# EAGLE schematic clock02 (EAGLE 7.2.0)
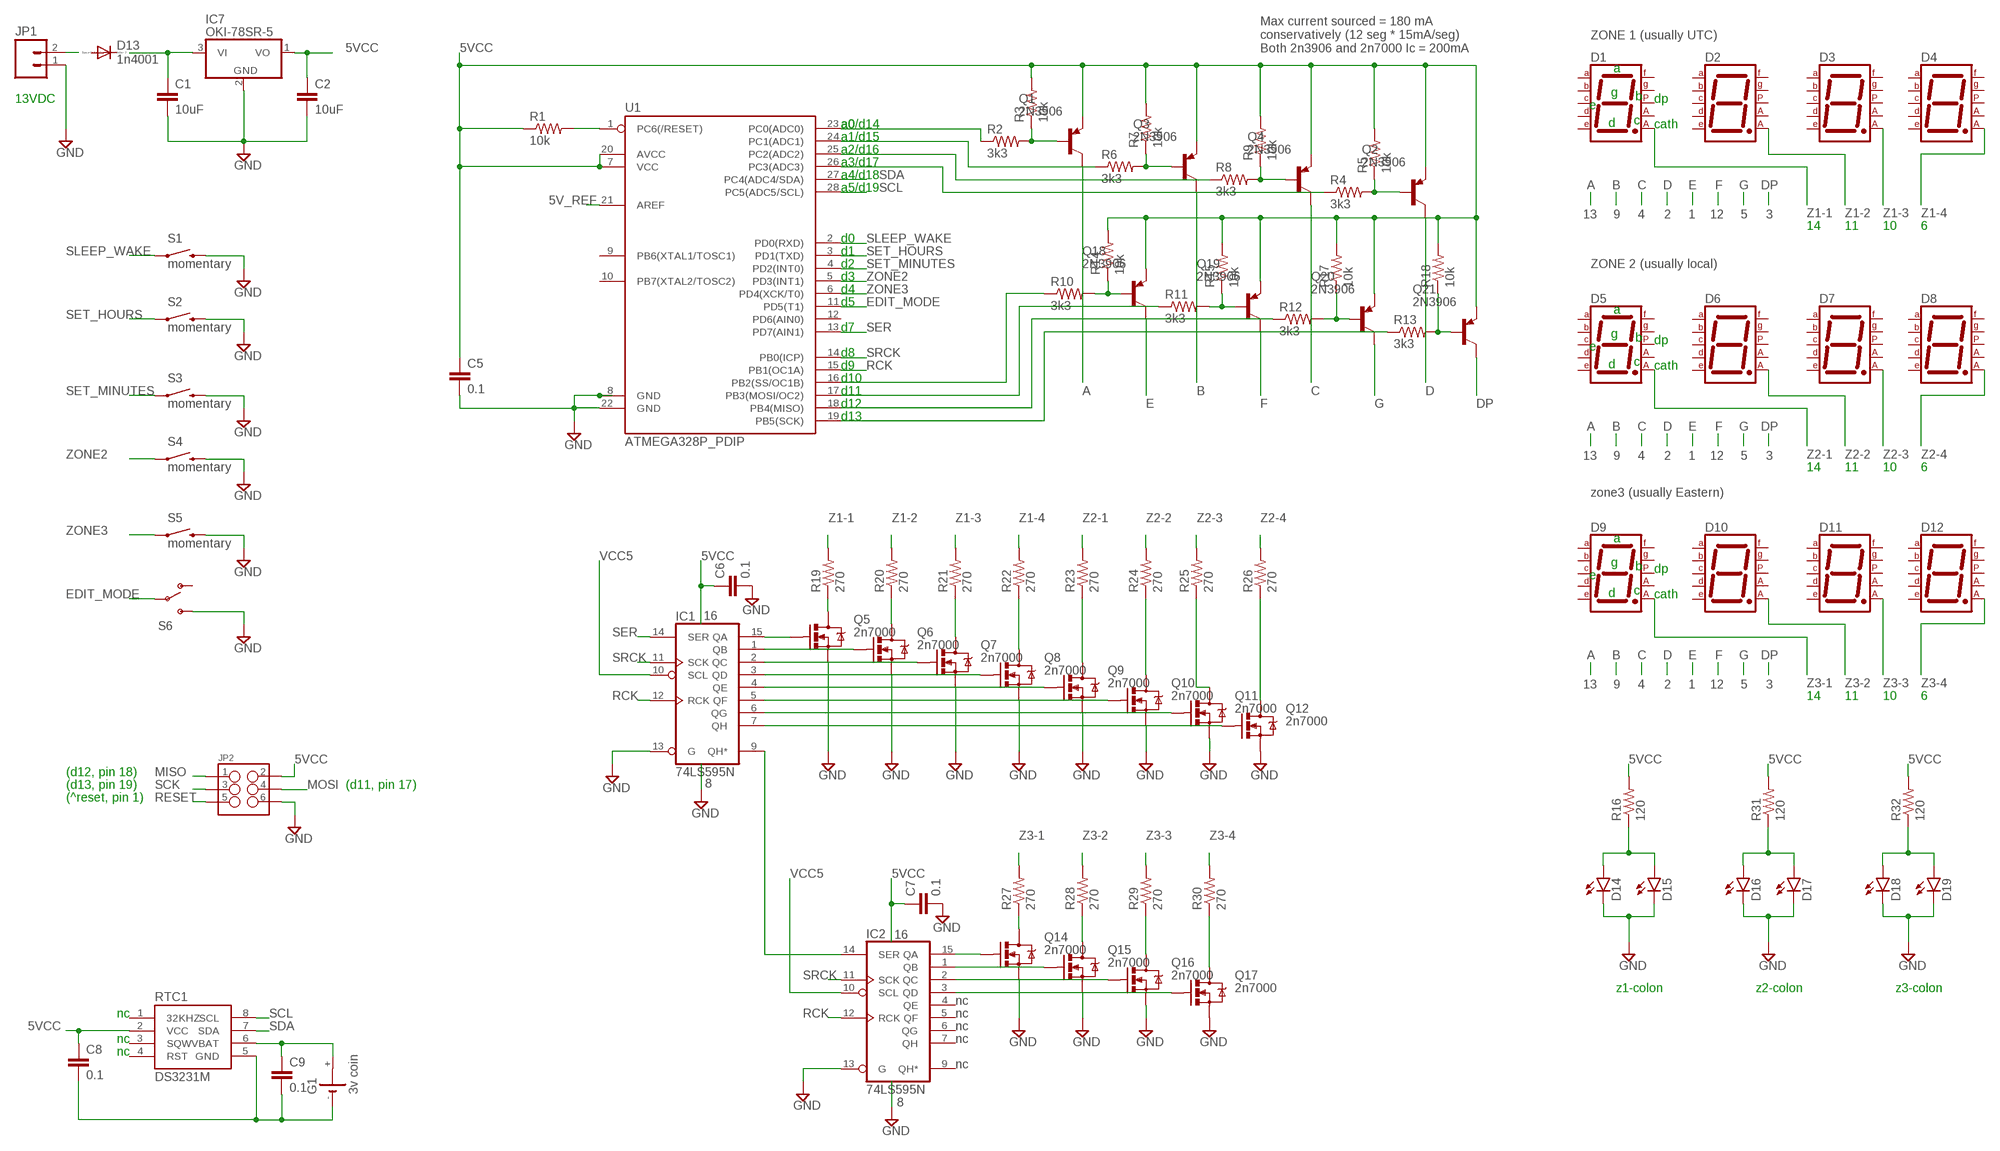
[diagram p0: schematic, sheet 1]

## Parts
C1  10uF  10NF/10000PF-50V-10%(0603)  [0603-CAP]
C2  10uF  10NF/10000PF-50V-10%(0603)  [0603-CAP]
C5  0.1  10NF/10000PF-50V-10%(0603)  [0603-CAP]
C6  0.1  10NF/10000PF-50V-10%(0603)  [0603-CAP]
C7  0.1  10NF/10000PF-50V-10%(0603)  [0603-CAP]
C8  0.1  10NF/10000PF-50V-10%(0603)  [0603-CAP]
C9  0.1  10NF/10000PF-50V-10%(0603)  [0603-CAP]
D1  7SEG-CA  [7SEG-13]
D2  7SEG-CA  [7SEG-13]
D3  7SEG-CA  [7SEG-13]
D4  7SEG-CA  [7SEG-13]
D5  7SEG-CA  [7SEG-13]
D6  7SEG-CA  [7SEG-13]
D7  7SEG-CA  [7SEG-13]
D8  7SEG-CA  [7SEG-13]
D9  7SEG-CA  [7SEG-13]
D10  7SEG-CA  [7SEG-13]
D11  7SEG-CA  [7SEG-13]
D12  7SEG-CA  [7SEG-13]
D13  1n4001  1N4004  [DO41-10]
D14  LED3MM  [LED3MM]
D15  LED3MM  [LED3MM]
D16  LED3MM  [LED3MM]
D17  LED3MM  [LED3MM]
D18  LED3MM  [LED3MM]
D19  LED3MM  [LED3MM]
G1  3v coin  CR2032H  [CR2032H]
IC1  74LS595N  [DIL16]
IC2  74LS595N  [DIL16]
IC7  OKI-78SR-5  78L05Z  [TO92]
JP1  M02-JST-2-PTH-NO_SILK  [JST-2-PTH-NS]
JP2  M03X2  [2X3_SMD]
Q1  2N3906  [TO92]
Q2  2N3906  [TO92]
Q3  2N3906  [TO92]
Q4  2N3906  [TO92]
Q5  2n7000  MOSFET-NCHANNEL2N7000  [TO-92]
Q6  2n7000  MOSFET-NCHANNEL2N7000  [TO-92]
Q7  2n7000  MOSFET-NCHANNEL2N7000  [TO-92]
Q8  2n7000  MOSFET-NCHANNEL2N7000  [TO-92]
Q9  2n7000  MOSFET-NCHANNEL2N7000  [TO-92]
Q10  2n7000  MOSFET-NCHANNEL2N7000  [TO-92]
Q11  2n7000  MOSFET-NCHANNEL2N7000  [TO-92]
Q12  2n7000  MOSFET-NCHANNEL2N7000  [TO-92]
Q14  2n7000  MOSFET-NCHANNEL2N7000  [TO-92]
Q15  2n7000  MOSFET-NCHANNEL2N7000  [TO-92]
Q16  2n7000  MOSFET-NCHANNEL2N7000  [TO-92]
Q17  2n7000  MOSFET-NCHANNEL2N7000  [TO-92]
Q18  2N3906  [TO92]
Q19  2N3906  [TO92]
Q20  2N3906  [TO92]
Q21  2N3906  [TO92]
R1  10k  10KOHM-1/4W-1%(PTH)HORIZ  [AXIAL-0.3]
R2  3k3  10KOHM-1/4W-1%(PTH)HORIZ  [AXIAL-0.3]
R3  10k  10KOHM-1/4W-1%(PTH)HORIZ  [AXIAL-0.3]
R4  3k3  10KOHM-1/4W-1%(PTH)HORIZ  [AXIAL-0.3]
R5  10k  10KOHM-1/4W-1%(PTH)HORIZ  [AXIAL-0.3]
R6  3k3  10KOHM-1/4W-1%(PTH)HORIZ  [AXIAL-0.3]
R7  10k  10KOHM-1/4W-1%(PTH)HORIZ  [AXIAL-0.3]
R8  3k3  10KOHM-1/4W-1%(PTH)HORIZ  [AXIAL-0.3]
R9  10k  10KOHM-1/4W-1%(PTH)HORIZ  [AXIAL-0.3]
R10  3k3  10KOHM-1/4W-1%(PTH)HORIZ  [AXIAL-0.3]
R11  3k3  10KOHM-1/4W-1%(PTH)HORIZ  [AXIAL-0.3]
R12  3k3  10KOHM-1/4W-1%(PTH)HORIZ  [AXIAL-0.3]
R13  3k3  10KOHM-1/4W-1%(PTH)HORIZ  [AXIAL-0.3]
R14  10k  10KOHM-1/4W-1%(PTH)HORIZ  [AXIAL-0.3]
R15  10k  10KOHM-1/4W-1%(PTH)HORIZ  [AXIAL-0.3]
R16  120  10KOHM-1/4W-1%(PTH)HORIZ  [AXIAL-0.3]
R17  10k  10KOHM-1/4W-1%(PTH)HORIZ  [AXIAL-0.3]
R18  10k  10KOHM-1/4W-1%(PTH)HORIZ  [AXIAL-0.3]
R19  270  10KOHM-1/4W-1%(PTH)HORIZ  [AXIAL-0.3]
R20  270  10KOHM-1/4W-1%(PTH)HORIZ  [AXIAL-0.3]
R21  270  10KOHM-1/4W-1%(PTH)HORIZ  [AXIAL-0.3]
R22  270  10KOHM-1/4W-1%(PTH)HORIZ  [AXIAL-0.3]
R23  270  10KOHM-1/4W-1%(PTH)HORIZ  [AXIAL-0.3]
R24  270  10KOHM-1/4W-1%(PTH)HORIZ  [AXIAL-0.3]
R25  270  10KOHM-1/4W-1%(PTH)HORIZ  [AXIAL-0.3]
R26  270  10KOHM-1/4W-1%(PTH)HORIZ  [AXIAL-0.3]
R27  270  10KOHM-1/4W-1%(PTH)HORIZ  [AXIAL-0.3]
R28  270  10KOHM-1/4W-1%(PTH)HORIZ  [AXIAL-0.3]
R29  270  10KOHM-1/4W-1%(PTH)HORIZ  [AXIAL-0.3]
R30  270  10KOHM-1/4W-1%(PTH)HORIZ  [AXIAL-0.3]
R31  120  10KOHM-1/4W-1%(PTH)HORIZ  [AXIAL-0.3]
R32  120  10KOHM-1/4W-1%(PTH)HORIZ  [AXIAL-0.3]
RTC1  DS3231M  [SOIC8]
S1  momentary  SWITCH-MOMENTARY-2PTH_REED  [REED_SWITCH_PTH]
S2  momentary  SWITCH-MOMENTARY-2PTH_REED  [REED_SWITCH_PTH]
S3  momentary  SWITCH-MOMENTARY-2PTH_REED  [REED_SWITCH_PTH]
S4  momentary  SWITCH-MOMENTARY-2PTH_REED  [REED_SWITCH_PTH]
S5  momentary  SWITCH-MOMENTARY-2PTH_REED  [REED_SWITCH_PTH]
S6  SWITCH-SPDTPTH  [SWITCH-SPDT]
U1  ATMEGA328P_PDIP  [DIL28-3]

## Nets
5V_REF: U1.21(AREF)
5VCC: C2.1 C5.1 C6.1 C7.1 C8.1 IC7.1(VO) JP2.2 Q1.3(E) Q2.3(E) Q3.3(E) Q4.3(E) Q18.3(E) Q19.3(E) Q20.3(E) Q21.3(E) R1.P$1 R3.P$2 R5.P$2 R7.P$2 R9.P$2 R14.P$2 R15.P$2 R16.P$2 R17.P$2 R18.P$2 R31.P$2 R32.P$2 RTC1.2(VCC) U1.7(VCC) U1.20(AVCC)
13V_IN: C1.1 IC7.3(VI)
A: Q1.1(C)
B: Q3.1(C)
C: Q4.1(C)
D: Q2.1(C)
DP: Q21.1(C)
E: Q18.1(C)
EDIT_MODE: S6.2(P) U1.11(PD5(T1))
F: Q19.1(C)
G: Q20.1(C)
GND: C1.2 C2.2 C5.2 C6.2 C7.2 D14.K(C) D15.K(C) D16.K(C) D17.K(C) D18.K(C) D19.K(C) IC1.13(G) IC2.13(G) IC7.2(GND) JP1.1 JP2.6 Q5.1(S) Q6.1(S) Q7.1(S) Q8.1(S) Q9.1(S) Q10.1(S) Q11.1(S) Q12.1(S) Q14.1(S) Q15.1(S) Q16.1(S) Q17.1(S) S1.P$2 S2.P$2 S3.P$2 S4.P$2 S5.P$2 S6.3(S) U1.8(GND) U1.22(GND)
MISO: JP2.1
MOSI: JP2.4
N$1: Q1.2(B) R2.P$2 R3.P$1
N$2: R2.P$1 U1.23(PC0(ADC0))
N$3: Q2.2(B) R4.P$2 R5.P$1
N$4: JP1.2
N$5: C8.2 C9.2 G1.- RTC1.5(GND)
N$6: C9.1 G1.+ RTC1.6(VBAT)
N$7: R6.P$1 U1.24(PC1(ADC1))
N$8: R8.P$1 U1.25(PC2(ADC2))
N$11: Q3.2(B) R6.P$2 R7.P$1
N$12: R4.P$1 U1.26(PC3(ADC3))
N$13: R1.P$2 U1.1(PC6(/RESET))
N$14: Q4.2(B) R8.P$2 R9.P$1
N$15: IC1.15(QA) Q5.2(G)
N$16: IC2.15(QA) Q14.2(G)
N$17: IC2.1(QB) Q15.2(G)
N$18: IC1.1(QB) Q6.2(G)
N$19: IC1.2(QC) Q7.2(G)
N$20: IC1.3(QD) Q8.2(G)
N$21: IC1.4(QE) Q9.2(G)
N$22: D14.A D15.A R16.P$1
N$23: D16.A D17.A R31.P$1
N$24: IC1.5(QF) Q10.2(G)
N$25: IC1.6(QG) Q11.2(G)
N$26: IC1.7(QH) Q12.2(G)
N$27: IC1.9(QH*) IC2.14(SER)
N$28: IC2.2(QC) Q16.2(G)
N$29: IC2.3(QD) Q17.2(G)
N$30: Q5.3(D) R19.P$1
N$31: Q6.3(D) R20.P$1
N$32: Q7.3(D) R21.P$1
N$33: D18.A D19.A R32.P$1
N$34: Q8.3(D) R22.P$1
N$36: Q20.2(B) R12.P$2 R17.P$1
N$37: Q21.2(B) R13.P$2 R18.P$1
N$38: R10.P$1 U1.16(PB2(SS/OC1B))
N$39: Q18.2(B) R10.P$2 R14.P$1
N$40: Q19.2(B) R11.P$2 R15.P$1
N$41: R11.P$1 U1.17(PB3(MOSI/OC2))
N$42: R12.P$1 U1.18(PB4(MISO))
N$43: R13.P$1 U1.19(PB5(SCK))
N$44: Q9.3(D) R23.P$1
N$45: Q10.3(D) R24.P$1
N$46: Q11.3(D) R25.P$1
N$47: Q12.3(D) R26.P$1
N$48: Q14.3(D) R27.P$1
N$49: Q15.3(D) R28.P$1
N$50: Q16.3(D) R29.P$1
N$51: Q17.3(D) R30.P$1
RCK: IC1.12(RCK) IC2.12(RCK) U1.15(PB1(OC1A))
RESET: JP2.5
SCK: JP2.3
SCL: RTC1.8(SCL) U1.28(PC5(ADC5/SCL))
SDA: RTC1.7(SDA) U1.27(PC4(ADC4/SDA))
SER: IC1.14(SER) U1.13(PD7(AIN1))
SET_HOURS: S2.P$1 U1.3(PD1(TXD))
SET_MINUTES: S3.P$1 U1.4(PD2(INT0))
SLEEP_WAKE: S1.P$1 U1.2(PD0(RXD))
SRCK: IC1.11(SCK) IC2.11(SCK) U1.14(PB0(ICP))
VCC5: IC1.10(SCL) IC2.10(SCL)
Z1-1: D1.8(CA2) R19.P$2
Z1-2: D2.8(CA2) R20.P$2
Z1-3: D3.8(CA2) R21.P$2
Z1-4: D4.8(CA2) R22.P$2
Z2-1: D5.8(CA2) R23.P$2
Z2-2: D6.8(CA2) R24.P$2
Z2-3: D7.8(CA2) R25.P$2
Z2-4: D8.8(CA2) R26.P$2
Z3-1: D9.8(CA2) R27.P$2
Z3-2: D10.8(CA2) R28.P$2
Z3-3: D11.8(CA2) R29.P$2
Z3-4: D12.8(CA2) R30.P$2
ZONE2: S4.P$1 U1.5(PD3(INT1))
ZONE3: S5.P$1 U1.6(PD4(XCK/T0))
Unconnected: D1.1(E) D1.2(D) D1.3(CA1) D1.4(C) D1.5(DP) D1.6(B) D1.7(A) D1.9(F) D1.10(G) D2.1(E) D2.2(D) D2.3(CA1) D2.4(C) D2.5(DP) D2.6(B) D2.7(A) D2.9(F) D2.10(G) D3.1(E) D3.2(D) D3.3(CA1) D3.4(C) D3.5(DP) D3.6(B) D3.7(A) D3.9(F) D3.10(G) D4.1(E) D4.2(D) D4.3(CA1) D4.4(C) D4.5(DP) D4.6(B) D4.7(A) D4.9(F) D4.10(G) D5.1(E) D5.2(D) D5.3(CA1) D5.4(C) D5.5(DP) D5.6(B) D5.7(A) D5.9(F) D5.10(G) D6.1(E) D6.2(D) D6.3(CA1) D6.4(C) D6.5(DP) D6.6(B) D6.7(A) D6.9(F) D6.10(G) D7.1(E) D7.2(D) D7.3(CA1) D7.4(C) D7.5(DP) D7.6(B) D7.7(A) D7.9(F) D7.10(G) D8.1(E) D8.2(D) D8.3(CA1) D8.4(C) D8.5(DP) D8.6(B) D8.7(A) D8.9(F) D8.10(G) D9.1(E) D9.2(D) D9.3(CA1) D9.4(C) D9.5(DP) D9.6(B) D9.7(A) D9.9(F) D9.10(G) D10.1(E) D10.2(D) D10.3(CA1) D10.4(C) D10.5(DP) D10.6(B) D10.7(A) D10.9(F) D10.10(G) D11.1(E) D11.2(D) D11.3(CA1) D11.4(C) D11.5(DP) D11.6(B) D11.7(A) D11.9(F) D11.10(G) D12.1(E) D12.2(D) D12.3(CA1) D12.4(C) D12.5(DP) D12.6(B) D12.7(A) D12.9(F) D12.10(G) D13.A D13.C G1.+@1(+) IC2.4(QE) IC2.5(QF) IC2.6(QG) IC2.7(QH) IC2.9(QH*) RTC1.1(32KHZ) RTC1.3(SQW) RTC1.4(RST) S6.1(O) U1.9(PB6(XTAL1/TOSC1)) U1.10(PB7(XTAL2/TOSC2)) U1.12(PD6(AIN0))

## Notes on the sheet
- ZONE 1 (usually UTC)
- Max current sourced = 180 mA
  conservatively (12 seg * 15mA/seg)
  Both 2n3906 and 2n7000 Ic = 200mA
- a
- g
- 13VDC | b | dp
- e
- d | c
- a0 | a0/d14 | cath
- a1/d15
- a2/d16
- a3/d17
- a4/d18
- a5/d19
- 13 | 9 | 4 | 2 | 1 | 12 | 5 | 3
- 14 | 11 | 10 | 6
- d0
- d1
- d2 | ZONE 2 (usually local)
- d3
- d4
- d5
- a
- d7
- g
- b | dp
- e
- d8
- d | c
- d9 | cath
- d10
- d11
- d12
- d13
- 13 | 9 | 4 | 2 | 1 | 12 | 5 | 3
- 14 | 11 | 10 | 6
- zone3 (usually Eastern)
- a
- g
- b | dp
- e
- d | c
- cath
- 16
- 13 | 9 | 4 | 2 | 1 | 12 | 5 | 3
- 14 | 11 | 10 | 6
- (d12, pin 18)
- (d13, pin 19) | (d11, pin 17) | 8
- (^reset, pin 1)
- 16
- z1-colon | z2-colon | z3-colon
- nc
- nc | nc
- nc
- nc | nc
- nc
- nc
- 8

## Power pins joined to a net without a drawn wire
GND: IC1.8(GND) IC2.8(GND)
VCC: IC1.16(VCC) IC2.16(VCC)

## Library data of the parts
C1 C2 C5-C9 = SparkFun-Capacitors:10NF/10000PF-50V-10%(0603): CAP-00867; PROD_ID: CAP-00867; VALUE: 10nF
D1-D12 = special:7SEG-CA: 7-segment DISPLAY single anode, 13 mm
D13 = diode:1N4004: DIODE general purpose rectifier, 1 A
D14-D19 = SparkFun-LED:LED: LEDs Standard schematic elements and footprints for 5mm, 3mm, 1206, and 0603 sized LEDs. 5mm - Spark Fun Electronics SKU : COM-00529 (and others)
G1 = battery:CR2032H: LI BATTERY Varta
IC1 IC2 = 74xx-us:74*595: 8-bit SHIFT REGISTER, output latch
IC7 = linear:78*: Positive VOLTAGE REGULATOR Source: http://cache.national.com/ds/LM/LM78L05.pdf http://www.fairchildsemi.com/ds/LM/LM7805.pdf
JP1 = SparkFun-Connectors:M02: Standard 2-pin 0.1" header. Use with - straight break away headers ( PRT-00116) - right angle break away headers (PRT-00553) - swiss pins (PRT-00743) - machine pins (PRT-00117) - female headers (PRT-00115) Molex polarized connector foot print use with: PRT-08233 with associated crimp pins and housings. 2.54_SCREWTERM for use with PRT-10571. 3.5mm Screw Terminal footprints for PRT-08084 5mm Screw Terminal footprints for use with PRT-08432
JP2 = SparkFun-Connectors:M03X2: 2x3 .1" header. Shrouded, with keying- CONN-10681 SMT- CONN-11415 Pogo pins- HW-11044; PROD_ID: CONN-11290
Q1-Q4 Q18-Q21 = transistor-pnp:2N3906: PNP Transistor
Q5-Q12 Q14-Q17 = SparkFun-DiscreteSemi:MOSFET-NCHANNEL: Common NMOSFET Parts MFG P/N Store ID Prod ID FDD8780 TRANS-09984 SI7820DN TRANS-11055 FDS6630A IC-08089 2N7002PW TRANS-11151 FQP30N06L COM-10213 TRANS-10060 BSS123LT1G TRANS-08345 BSS138 TRANS-00830 BS170 2N7000
R1 R3 R5 R7 R9 R14 R15 R17 R18 = SparkFun-Resistors:10KOHM-1/4W-1%(PTH): RES-12183; PROD_ID: RES-12183
R2 R4 R6 R8 R10-R13 R16 R19-R32 = SparkFun-Resistors:10KOHM-1/4W-1%(PTH): RES-12183; PROD_ID: RES-12183; VALUE: 10k
RTC1 = SparkFun-DigitalIC:DS3231M: DS3231M Real Time Clock. Accuracy +/-5ppm. Battery Backup. 2.3V to 5.5V.; PROD_ID: IC-11985
S1-S5 = SparkFun-Electromechanical:SWITCH-MOMENTARY-2: Various NO switches- pushbuttons, reed, etc
S6 = SparkFun-Electromechanical:SWITCH-SPDT: SPDT Switch Simple slide switch, Spark Fun Electronics SKU : COM-00102 DPDT SMT slide switch, AYZ0202, SWCH-08179; PROD_ID: SWCH-08261
U1 = SparkFun-DigitalIC:ATMEGA328P_PDIP: uC used in the Arduino 32kb flash, 1k EEPROM, 2k SRAM This is the through-hole version of this chip.